# Altium schematic sheet 14-DSP eLINK CONNECTORS.SchDoc
size 513 x 386 mm
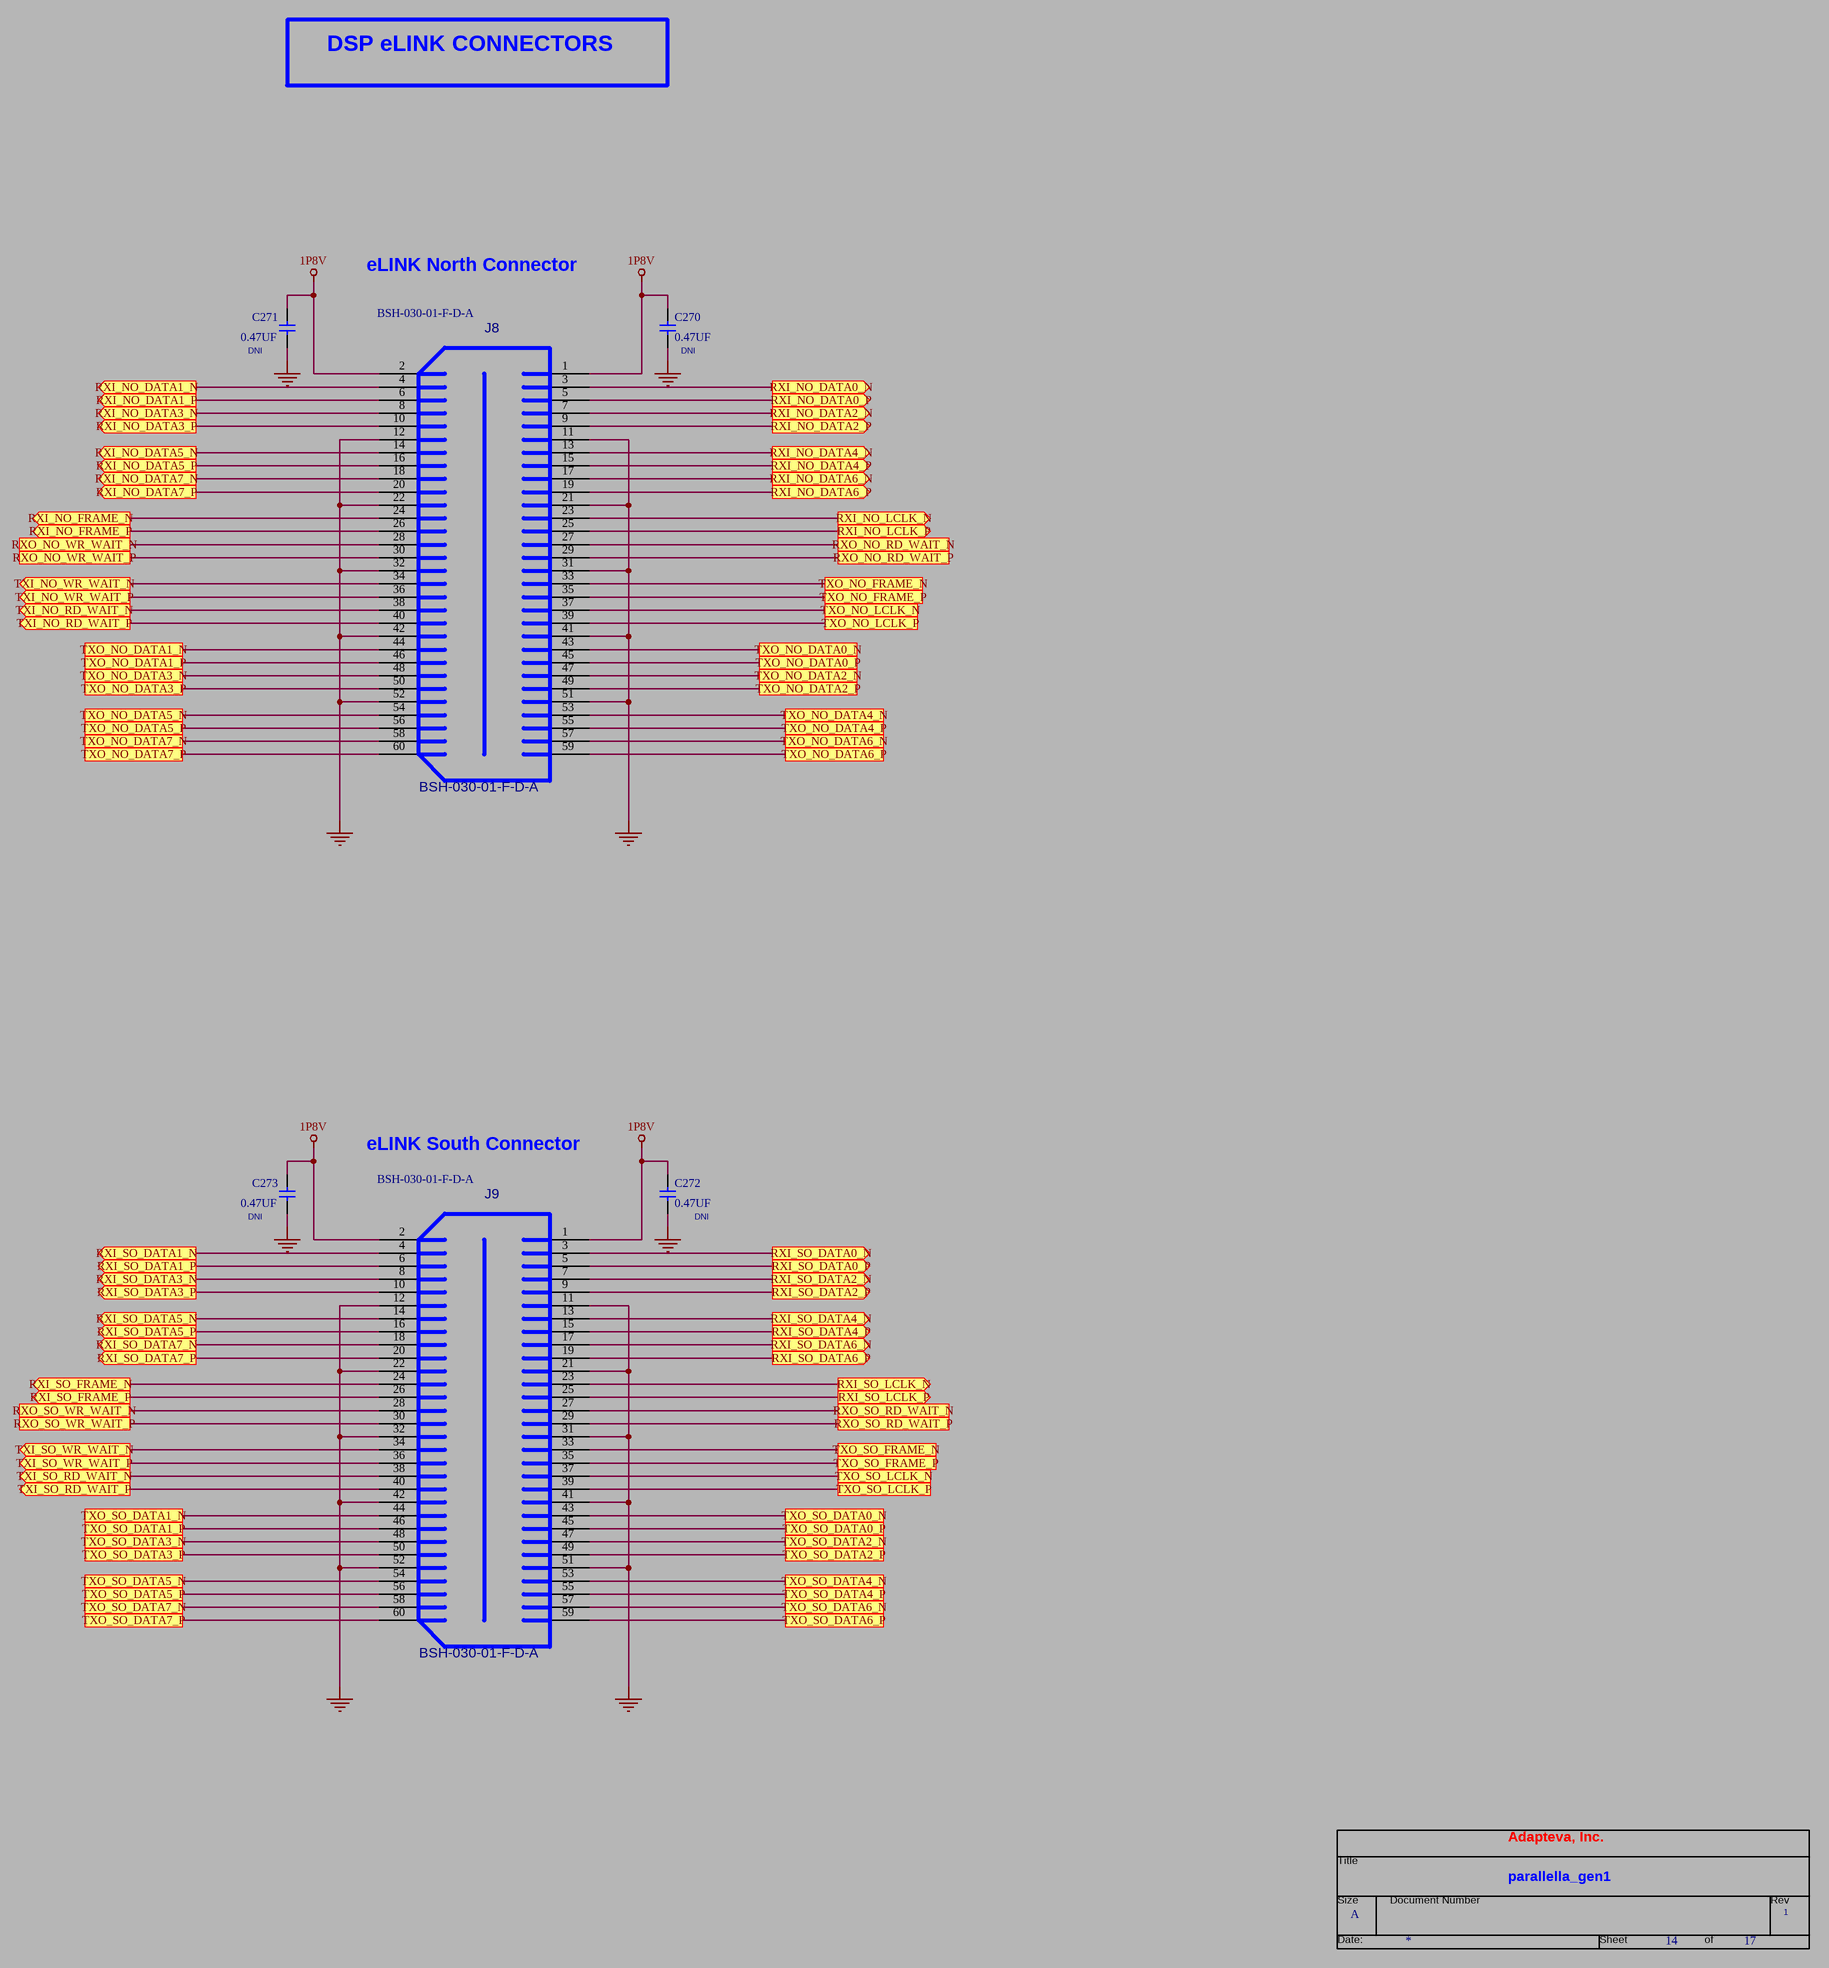
[diagram p0: 14-DSP eLINK CONNECTORS.SchDoc]

## Parts
*  RevCode: 1  Title: parallella_gen1  Page Size: A  Page Number: 14  Page Count: 17  OrgAddr1: Adapteva, Inc.  (hidden comment: TitleBlock0)  (graphical)
C270  0.47UF  INSTALL: DNI  [C0402]
C271  0.47UF  INSTALL: DNI  [C0402]
C272  0.47UF  INSTALL: DNI  [C0402]
C273  0.47UF  INSTALL: DNI  [C0402]
J8  BSH-030-01-F-D-A  [CONN_BSH60P_13P59X25P88_P5P_V]
J9  BSH-030-01-F-D-A  [CONN_BSH60P_13P59X25P88_P5P_V]

## Ports
RXI_NO_DATA0_N (out), RXI_NO_DATA0_P (out), RXI_NO_DATA1_N (out), RXI_NO_DATA1_P (out), RXI_NO_DATA2_N (out), RXI_NO_DATA2_P (out), RXI_NO_DATA3_N (out), RXI_NO_DATA3_P (out), RXI_NO_DATA4_N (out), RXI_NO_DATA4_P (out), RXI_NO_DATA5_N (out), RXI_NO_DATA5_P (out), RXI_NO_DATA6_N (out), RXI_NO_DATA6_P (out), RXI_NO_DATA7_N (out), RXI_NO_DATA7_P (out), RXI_NO_FRAME_N (out), RXI_NO_FRAME_P (out), RXI_NO_LCLK_N (out), RXI_NO_LCLK_P (out), RXI_SO_DATA0_N (out), RXI_SO_DATA0_P (out), RXI_SO_DATA1_N (out), RXI_SO_DATA1_P (out), RXI_SO_DATA2_N (out), RXI_SO_DATA2_P (out), RXI_SO_DATA3_N (out), RXI_SO_DATA3_P (out), RXI_SO_DATA4_N (out), RXI_SO_DATA4_P (out), RXI_SO_DATA5_N (out), RXI_SO_DATA5_P (out), RXI_SO_DATA6_N (out), RXI_SO_DATA6_P (out), RXI_SO_DATA7_N (out), RXI_SO_DATA7_P (out), RXI_SO_FRAME_N (out), RXI_SO_FRAME_P (out), RXI_SO_LCLK_N (out), RXI_SO_LCLK_P (out), RXO_NO_RD_WAIT_N, RXO_NO_RD_WAIT_P, RXO_NO_WR_WAIT_N, RXO_NO_WR_WAIT_P, RXO_SO_RD_WAIT_N, RXO_SO_RD_WAIT_P, RXO_SO_WR_WAIT_N, RXO_SO_WR_WAIT_P, TXI_NO_RD_WAIT_N (out), TXI_NO_RD_WAIT_P (out), TXI_NO_WR_WAIT_N (out), TXI_NO_WR_WAIT_P (out), TXI_SO_RD_WAIT_N (out), TXI_SO_RD_WAIT_P (out), TXI_SO_WR_WAIT_N (out), TXI_SO_WR_WAIT_P (out), TXO_NO_DATA0_N, TXO_NO_DATA0_P, TXO_NO_DATA1_N, TXO_NO_DATA1_P, TXO_NO_DATA2_N, TXO_NO_DATA2_P, TXO_NO_DATA3_N, TXO_NO_DATA3_P, TXO_NO_DATA4_N, TXO_NO_DATA4_P, TXO_NO_DATA5_N, TXO_NO_DATA5_P, TXO_NO_DATA6_N, TXO_NO_DATA6_P, TXO_NO_DATA7_N, TXO_NO_DATA7_P, TXO_NO_FRAME_N, TXO_NO_FRAME_P, TXO_NO_LCLK_N, TXO_NO_LCLK_P, TXO_SO_DATA0_N, TXO_SO_DATA0_P, TXO_SO_DATA1_N, TXO_SO_DATA1_P, TXO_SO_DATA2_N, TXO_SO_DATA2_P, TXO_SO_DATA3_N, TXO_SO_DATA3_P, TXO_SO_DATA4_N, TXO_SO_DATA4_P, TXO_SO_DATA5_N, TXO_SO_DATA5_P, TXO_SO_DATA6_N, TXO_SO_DATA6_P, TXO_SO_DATA7_N, TXO_SO_DATA7_P, TXO_SO_FRAME_N, TXO_SO_FRAME_P, TXO_SO_LCLK_N, TXO_SO_LCLK_P

## Nets
1P8V: C270.1 C271.1 C272.1 C273.1 J8.1 J8.2 J9.1 J9.2
GND: C270.2 C271.2 C272.2 C273.2 J8.11 J8.12 J8.21 J8.22 J8.31 J8.32 J8.41 J8.42 J8.51 J8.52 J9.11 J9.12 J9.21 J9.22 J9.31 J9.32 J9.41 J9.42 J9.51 J9.52
RXI_NO_DATA0_N: J8.3 ; port RXI_NO_DATA0_N
RXI_NO_DATA0_P: J8.5 ; port RXI_NO_DATA0_P
RXI_NO_DATA1_N: J8.4 ; port RXI_NO_DATA1_N
RXI_NO_DATA1_P: J8.6 ; port RXI_NO_DATA1_P
RXI_NO_DATA2_N: J8.7 ; port RXI_NO_DATA2_N
RXI_NO_DATA2_P: J8.9 ; port RXI_NO_DATA2_P
RXI_NO_DATA3_N: J8.8 ; port RXI_NO_DATA3_N
RXI_NO_DATA3_P: J8.10 ; port RXI_NO_DATA3_P
RXI_NO_DATA4_N: J8.13 ; port RXI_NO_DATA4_N
RXI_NO_DATA4_P: J8.15 ; port RXI_NO_DATA4_P
RXI_NO_DATA5_N: J8.14 ; port RXI_NO_DATA5_N
RXI_NO_DATA5_P: J8.16 ; port RXI_NO_DATA5_P
RXI_NO_DATA6_N: J8.17 ; port RXI_NO_DATA6_N
RXI_NO_DATA6_P: J8.19 ; port RXI_NO_DATA6_P
RXI_NO_DATA7_N: J8.18 ; port RXI_NO_DATA7_N
RXI_NO_DATA7_P: J8.20 ; port RXI_NO_DATA7_P
RXI_NO_FRAME_N: J8.24 ; port RXI_NO_FRAME_N
RXI_NO_FRAME_P: J8.26 ; port RXI_NO_FRAME_P
RXI_NO_LCLK_N: J8.23 ; port RXI_NO_LCLK_N
RXI_NO_LCLK_P: J8.25 ; port RXI_NO_LCLK_P
RXI_SO_DATA0_N: J9.3 ; port RXI_SO_DATA0_N
RXI_SO_DATA0_P: J9.5 ; port RXI_SO_DATA0_P
RXI_SO_DATA1_N: J9.4 ; port RXI_SO_DATA1_N
RXI_SO_DATA1_P: J9.6 ; port RXI_SO_DATA1_P
RXI_SO_DATA2_N: J9.7 ; port RXI_SO_DATA2_N
RXI_SO_DATA2_P: J9.9 ; port RXI_SO_DATA2_P
RXI_SO_DATA3_N: J9.8 ; port RXI_SO_DATA3_N
RXI_SO_DATA3_P: J9.10 ; port RXI_SO_DATA3_P
RXI_SO_DATA4_N: J9.13 ; port RXI_SO_DATA4_N
RXI_SO_DATA4_P: J9.15 ; port RXI_SO_DATA4_P
RXI_SO_DATA5_N: J9.14 ; port RXI_SO_DATA5_N
RXI_SO_DATA5_P: J9.16 ; port RXI_SO_DATA5_P
RXI_SO_DATA6_N: J9.17 ; port RXI_SO_DATA6_N
RXI_SO_DATA6_P: J9.19 ; port RXI_SO_DATA6_P
RXI_SO_DATA7_N: J9.18 ; port RXI_SO_DATA7_N
RXI_SO_DATA7_P: J9.20 ; port RXI_SO_DATA7_P
RXI_SO_FRAME_N: J9.24 ; port RXI_SO_FRAME_N
RXI_SO_FRAME_P: J9.26 ; port RXI_SO_FRAME_P
RXI_SO_LCLK_N: J9.23 ; port RXI_SO_LCLK_N
RXI_SO_LCLK_P: J9.25 ; port RXI_SO_LCLK_P
RXO_NO_RD_WAIT_N: J8.27 ; port RXO_NO_RD_WAIT_N
RXO_NO_RD_WAIT_P: J8.29 ; port RXO_NO_RD_WAIT_P
RXO_NO_WR_WAIT_N: J8.28 ; port RXO_NO_WR_WAIT_N
RXO_NO_WR_WAIT_P: J8.30 ; port RXO_NO_WR_WAIT_P
RXO_SO_RD_WAIT_N: J9.27 ; port RXO_SO_RD_WAIT_N
RXO_SO_RD_WAIT_P: J9.29 ; port RXO_SO_RD_WAIT_P
RXO_SO_WR_WAIT_N: J9.28 ; port RXO_SO_WR_WAIT_N
RXO_SO_WR_WAIT_P: J9.30 ; port RXO_SO_WR_WAIT_P
TXI_NO_RD_WAIT_N: J8.38 ; port TXI_NO_RD_WAIT_N
TXI_NO_RD_WAIT_P: J8.40 ; port TXI_NO_RD_WAIT_P
TXI_NO_WR_WAIT_N: J8.34 ; port TXI_NO_WR_WAIT_N
TXI_NO_WR_WAIT_P: J8.36 ; port TXI_NO_WR_WAIT_P
TXI_SO_RD_WAIT_N: J9.38 ; port TXI_SO_RD_WAIT_N
TXI_SO_RD_WAIT_P: J9.40 ; port TXI_SO_RD_WAIT_P
TXI_SO_WR_WAIT_N: J9.34 ; port TXI_SO_WR_WAIT_N
TXI_SO_WR_WAIT_P: J9.36 ; port TXI_SO_WR_WAIT_P
TXO_NO_DATA0_N: J8.43 ; port TXO_NO_DATA0_N
TXO_NO_DATA0_P: J8.45 ; port TXO_NO_DATA0_P
TXO_NO_DATA1_N: J8.44 ; port TXO_NO_DATA1_N
TXO_NO_DATA1_P: J8.46 ; port TXO_NO_DATA1_P
TXO_NO_DATA2_N: J8.47 ; port TXO_NO_DATA2_N
TXO_NO_DATA2_P: J8.49 ; port TXO_NO_DATA2_P
TXO_NO_DATA3_N: J8.48 ; port TXO_NO_DATA3_N
TXO_NO_DATA3_P: J8.50 ; port TXO_NO_DATA3_P
TXO_NO_DATA4_N: J8.53 ; port TXO_NO_DATA4_N
TXO_NO_DATA4_P: J8.55 ; port TXO_NO_DATA4_P
TXO_NO_DATA5_N: J8.54 ; port TXO_NO_DATA5_N
TXO_NO_DATA5_P: J8.56 ; port TXO_NO_DATA5_P
TXO_NO_DATA6_N: J8.57 ; port TXO_NO_DATA6_N
TXO_NO_DATA6_P: J8.59 ; port TXO_NO_DATA6_P
TXO_NO_DATA7_N: J8.58 ; port TXO_NO_DATA7_N
TXO_NO_DATA7_P: J8.60 ; port TXO_NO_DATA7_P
TXO_NO_FRAME_N: J8.33 ; port TXO_NO_FRAME_N
TXO_NO_FRAME_P: J8.35 ; port TXO_NO_FRAME_P
TXO_NO_LCLK_N: J8.37 ; port TXO_NO_LCLK_N
TXO_NO_LCLK_P: J8.39 ; port TXO_NO_LCLK_P
TXO_SO_DATA0_N: J9.43 ; port TXO_SO_DATA0_N
TXO_SO_DATA0_P: J9.45 ; port TXO_SO_DATA0_P
TXO_SO_DATA1_N: J9.44 ; port TXO_SO_DATA1_N
TXO_SO_DATA1_P: J9.46 ; port TXO_SO_DATA1_P
TXO_SO_DATA2_N: J9.47 ; port TXO_SO_DATA2_N
TXO_SO_DATA2_P: J9.49 ; port TXO_SO_DATA2_P
TXO_SO_DATA3_N: J9.48 ; port TXO_SO_DATA3_N
TXO_SO_DATA3_P: J9.50 ; port TXO_SO_DATA3_P
TXO_SO_DATA4_N: J9.53 ; port TXO_SO_DATA4_N
TXO_SO_DATA4_P: J9.55 ; port TXO_SO_DATA4_P
TXO_SO_DATA5_N: J9.54 ; port TXO_SO_DATA5_N
TXO_SO_DATA5_P: J9.56 ; port TXO_SO_DATA5_P
TXO_SO_DATA6_N: J9.57 ; port TXO_SO_DATA6_N
TXO_SO_DATA6_P: J9.59 ; port TXO_SO_DATA6_P
TXO_SO_DATA7_N: J9.58 ; port TXO_SO_DATA7_N
TXO_SO_DATA7_P: J9.60 ; port TXO_SO_DATA7_P
TXO_SO_FRAME_N: J9.33 ; port TXO_SO_FRAME_N
TXO_SO_FRAME_P: J9.35 ; port TXO_SO_FRAME_P
TXO_SO_LCLK_N: J9.37 ; port TXO_SO_LCLK_N
TXO_SO_LCLK_P: J9.39 ; port TXO_SO_LCLK_P

## Notes on the sheet
- DSP eLINK CONNECTORS
- eLINK North Connector
- eLINK South Connector
- (in symbol TitleBlock0) Title; Size; Document Number; Rev; Date:; Sheet; of

## Library data of the parts
C270-C273 = CAP0402_0P47UF_X5R: CAP, 0402, 0.47UF, X5R, 16V; MFG PART NO: C1005X5R1C474K; MFG: TDK; ALT_SYMBOLS: C0402_BGA; DEVICE: CAP0402_0P47UF_X5R; Vendor: TDK; Vendor PN: C1005X5R1C474K; PCB Footprint: C0402
J8 J9 = CON_BSH_030_VERT: Vendor: SAMTEC; Vendor PN: BSH-030-01-F-D-A; DEVICE: CON_BSH_030_VERT; PCB Footprint: CONN_BSH60P_13P59X25P88_P5P_V; Supplier 1: Arrow; Supplier Part Number 1: BSH-030-01-F-D-A
* = TitleBlock0: Page Create Date: March  8, 1995; Page Modify Date: *